# Altium schematic sheet Telliskivi2014MainBoardPower.SchDoc
size A4
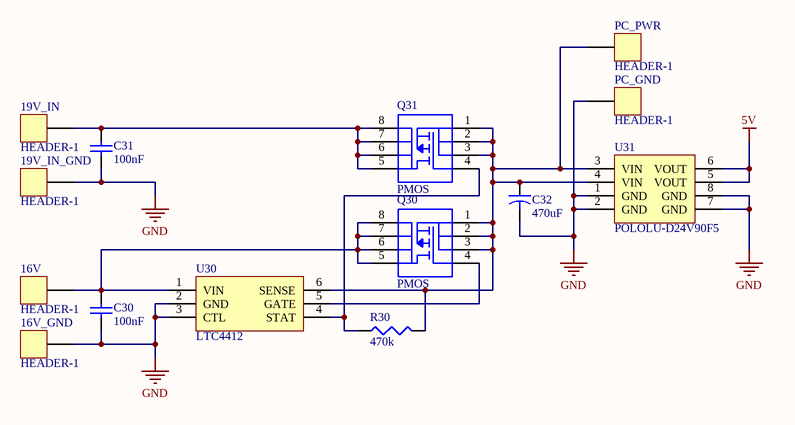
[diagram p0: Telliskivi2014MainBoardPower.SchDoc]

## Parts
16V  HEADER-1  [POWER-VIA]
16V_GND  HEADER-1  [POWER-VIA]
19V_IN  HEADER-1  [POWER-VIA]
19V_IN_GND  HEADER-1  [POWER-VIA]
C30  100nF  [1608[0603]]
C31  100nF  [1608[0603]]
C32  470uF  [CAPR5-4X5]
PC_GND  HEADER-1  [POWER-VIA]
PC_PWR  HEADER-1  [POWER-VIA]
Q30  PMOS  [SO8]
Q31  PMOS  [SO8]
R30  470k  [J1-0603]
U30  LTC4412  [TSOT-23-6]
U31  POLOLU-D24V90F5  [POLOLU-D24V90F5-NO-OUTLINE]

## Nets
5V: U31.5(VOUT) U31.6(VOUT)
GND: 16V_GND.1 19V_IN_GND.1 C30.2 C31.2 C32.2 PC_GND.1 U30.2(GND) U30.3(CTL) U31.1(GND) U31.2(GND) U31.7(GND) U31.8(GND)
Net16V_1: 16V.1 C30.1 Q30.5 Q30.6 Q30.7 Q30.8 U30.1(VIN)
Net19V_IN_1: 19V_IN.1 C31.1 Q31.5 Q31.6 Q31.7 Q31.8
NetC32_1: C32.1 PC_PWR.1 Q30.1 Q30.2 Q30.3 Q31.1 Q31.2 Q31.3 R30.2 U30.6(SENSE) U31.3(VIN) U31.4(VIN)
NetQ30_4: Q30.4 U30.5(GATE)
NetQ31_4: Q31.4 R30.1 U30.4(STAT)

## Library data of the parts
C30 C31 = Cap Semi: Capacitor (Semiconductor SIM Model); Value: 100pF; Published: 8-Jun-2000; LatestRevisionDate: 29-May-2009; LatestRevisionNote: IPC-7351 Footprint Added.; PackageReference: C1206; Publisher: Altium Limited; PackageDescription: Chip Capacitor
C32 = Cap2: Capacitor; Value: 100pF; Published: 23-Sep-2002; PackageReference: CAPR5-4X5; Publisher: Altium Limited; PackageDescription: Capacitor; 2 Leads
R30 = Res3: Resistor; Value: 1K; Published: 8-Jun-2000; LatestRevisionDate: 29-May-2009; LatestRevisionNote: IPC-7351 Footprint Added.; PackageReference: J1-0603; Publisher: Altium Limited; PackageDescription: Chip Resistor